# Altium schematic sheet CAN_schematic.SchDoc: CAN transceiver and test switches
size A4; Organization: UFSC; DocumentNumber: 5; SheetNumber: 5; SheetTotal: 8
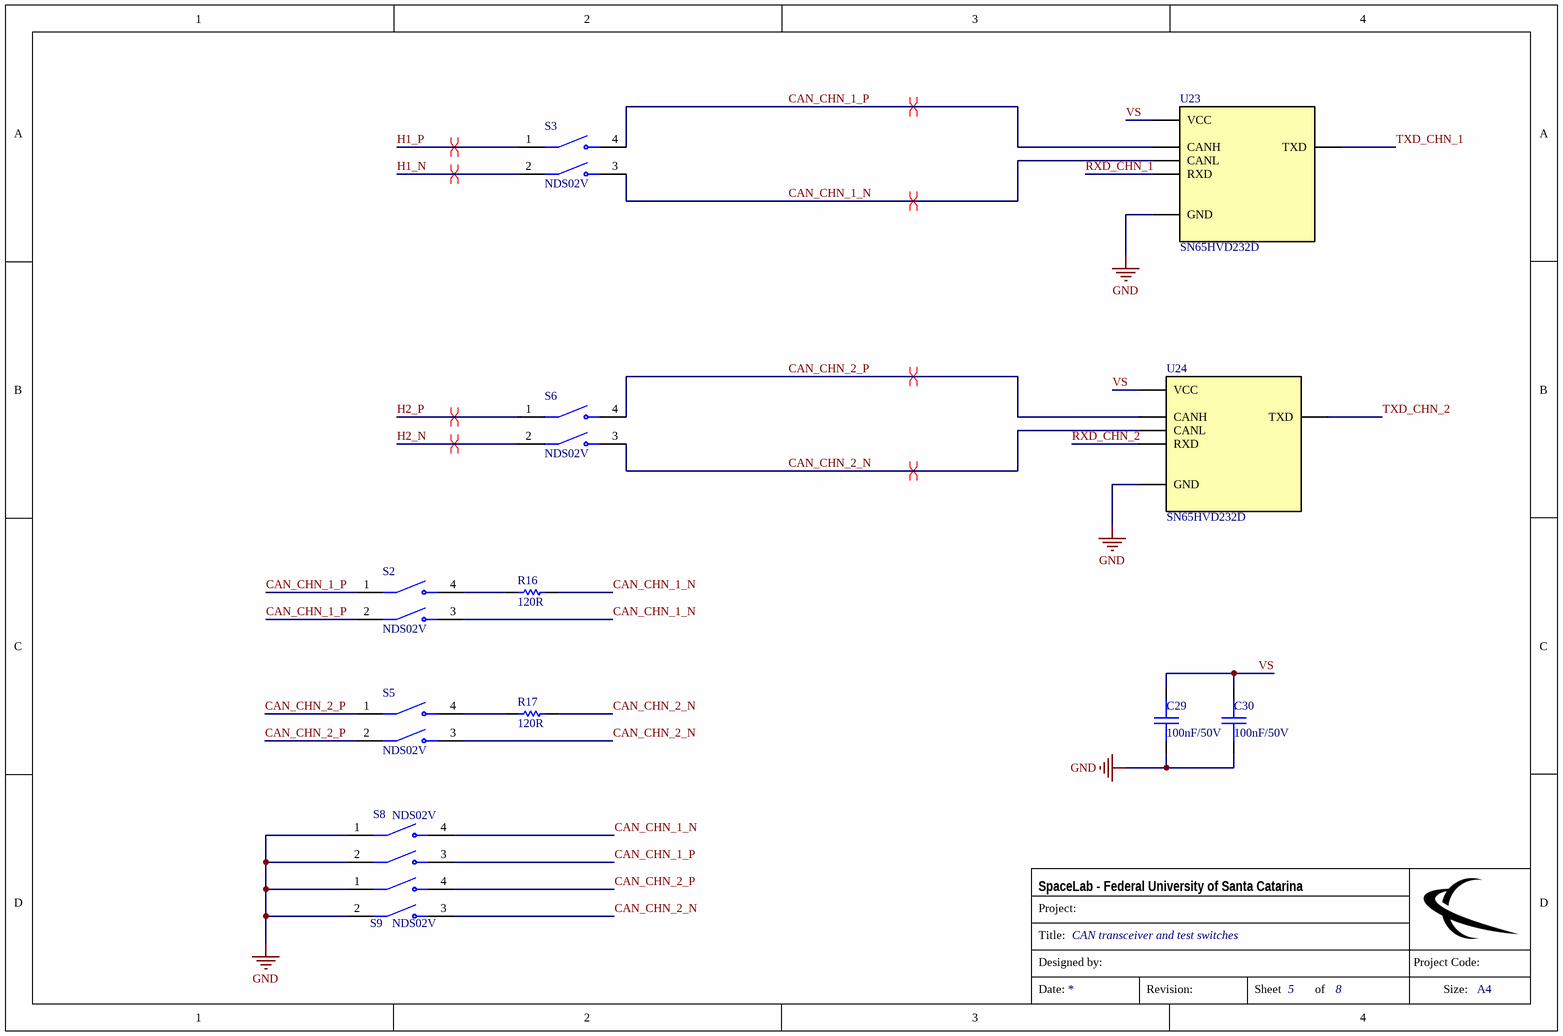
[diagram p0: CAN_schematic.SchDoc]

## Parts
C29  100nF/50V  [CC0603]
C30  100nF/50V  [CC0603]
R16  120R  [0805]
R17  120R  [0805]
S2  NDS02V  [NDS02V]
S3  NDS02V  [NDS02V]
S5  NDS02V  [NDS02V]
S6  NDS02V  [NDS02V]
S8  NDS02V  [NDS02V]
S9  NDS02V  [NDS02V]
U23  SN65HVD232D  [SOIC127P599X175-8N]
U24  SN65HVD232D  [SOIC127P599X175-8N]

## Nets
GND: C29.2 C30.2 S8.1(COM_1) S8.2(COM_2) S9.1(COM_1) S9.2(COM_2) U23.2(GND) U24.2(GND)
CAN_CHN_1_N: R16.1 S2.3(NO_1) S3.3(NO_1) S8.4(NO_2) U23.6(CANL)
CAN_CHN_1_P: S2.1(COM_1) S2.2(COM_2) S3.4(NO_2) S8.3(NO_1) U23.7(CANH)
CAN_CHN_2_N: R17.1 S5.3(NO_1) S6.3(NO_1) S9.3(NO_1) U24.6(CANL)
CAN_CHN_2_P: S5.1(COM_1) S5.2(COM_2) S6.4(NO_2) S9.4(NO_2) U24.7(CANH)
H1_N: S3.2(COM_2)
H1_P: S3.1(COM_1)
H2_N: S6.2(COM_2)
H2_P: S6.1(COM_1)
RXD_CHN_1: U23.4(RXD)
RXD_CHN_2: U24.4(RXD)
TXD_CHN_1: U23.1(TXD)
TXD_CHN_2: U24.1(TXD)
VS: C29.1 C30.1 U23.3(VCC) U24.3(VCC)
NetR16_2: R16.2 S2.4(NO_2)
NetR17_2: R17.2 S5.4(NO_2)

## Layout directives
differential pair: CAN_CHN_1_N, CAN_CHN_1_P, CAN_CHN_2_N, CAN_CHN_2_P, H1_N, H1_P, H2_N, H2_P

## Notes on the sheet
- Project:
- SpaceLab - Federal University of Santa Catarina
- Title:
- Designed by:
- Project Code:
- Date:
- Revision:
- Sheet
- of
- Size:
- A4
- (in symbol Cap_Cer_X7R_100nF_50V_0603) .

## Library data of the parts
C29 C30 = Cap_Cer_X7R_100nF_50V_0603: CAP CER 100nF 50V 10% X7R 0603; Manufacturer Part Number: C0603C104K5RAC3121; NCM: 8532.24.10
R16 R17 = R120R_1%_1/4W_0805: RES 120R OHM 1/8W 1% 0805; Manufacturer Part Number: CRGCQ0805F120R; NCM: 8533.21.20
S2 S3 S5 S6 S8 S9 = NDS02V: Switch; Manufacturer_Name: Apem; Datasheet Link: https://componentsearchengine.com/Datasheets/2/NDS02V.pdf; Height: 7.05mm; Manufacturer_Part_Number: NDS02V; Mouser Part Number: 642-NDS02V; Mouser Price/Stock: https://www.mouser.co.uk/ProductDetail/Apem/NDS02V?qs=Rt2YTNbomKgQBAMS%252Bs5rFQ%3D%3D
U23 U24 = SN65HVD232D: 3.3 V CAN Transceiver; MF: Texas Instruments; Availability: Unavailable; Package: SOIC-8 Texas Instruments; DigiKey-Purchase-URL: https://snapeda.com/shop?store=DigiKey&id=230614; SnapEDA_Link: https://www.snapeda.com/parts/SN65HVD232D/Texas%20Instruments/view-part/230614/?ref=snap; Mouser-Purchase-URL: https://snapeda.com/shop?store=Mouser&id=230614; Value: *; Price: None; Texas_Instruments-Purchase-URL: https://snapeda.com/shop?store=Texas+Instruments&id=230614; Manufacturer Part Number: SN65HVD232D